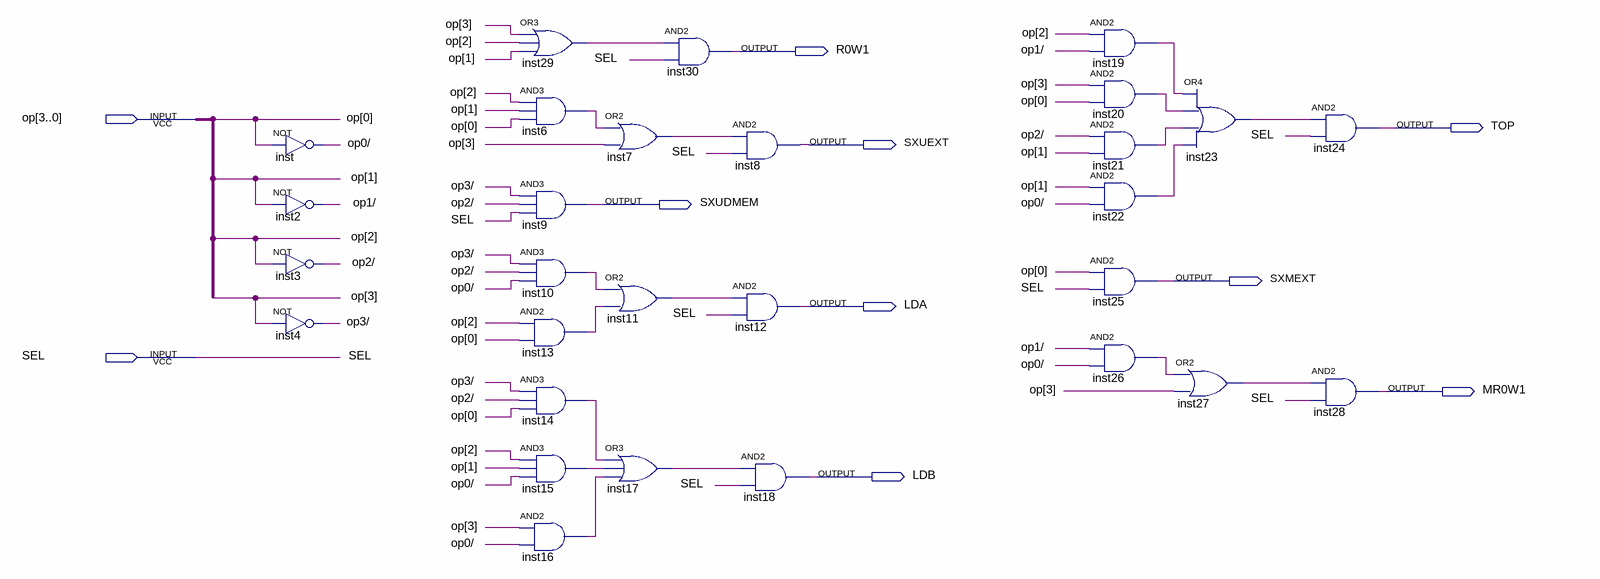
[diagram p0: schematic sheet]
// Quartus schematic decod_inst_trf_interno.bdf as structural Verilog: 29 symbols, 10 pins
module decod_inst_trf_interno (
  input  [3:0] op,
  input  SEL,
  output R0W1,
  output TOP,
  output SXUEXT,
  output SXUDMEM,
  output SXMEXT,
  output LDA,
  output MR0W1,
  output LDB
);

  wire inst6_out, inst7_out, inst10_out, inst11_out, inst13_out, inst14_out, inst15_out, inst16_out,
       inst17_out, inst19_out, inst20_out, inst21_out, inst22_out, inst23_out, inst26_out, inst27_out,
       inst29_out, \op0/ , \op1/ , \op2/ , \op3/ ;

  not inst (\op0/ , op[0]);
  not inst2 (\op1/ , op[1]);
  not inst3 (\op2/ , op[2]);
  not inst4 (\op3/ , op[3]);
  or inst29 (inst29_out, op[3], op[2], op[1]);
  and inst6 (inst6_out, op[2], op[1], op[0]);
  and inst9 (SXUDMEM, \op3/ , \op2/ , SEL);
  and inst10 (inst10_out, \op3/ , \op2/ , \op0/ );
  and inst13 (inst13_out, op[2], op[0]);
  and inst14 (inst14_out, \op3/ , \op2/ , op[0]);
  and inst15 (inst15_out, op[2], op[1], \op0/ );
  and inst16 (inst16_out, op[3], \op0/ );
  and inst30 (R0W1, inst29_out, SEL);
  or inst7 (inst7_out, inst6_out, op[3]);
  or inst11 (inst11_out, inst10_out, inst13_out);
  or inst17 (inst17_out, inst14_out, inst15_out, inst16_out);
  and inst8 (SXUEXT, inst7_out, SEL);
  and inst12 (LDA, inst11_out, SEL);
  and inst18 (LDB, inst17_out, SEL);
  and inst19 (inst19_out, op[2], \op1/ );
  and inst20 (inst20_out, op[3], op[0]);
  and inst21 (inst21_out, \op2/ , op[1]);
  and inst22 (inst22_out, op[1], \op0/ );
  and inst25 (SXMEXT, op[0], SEL);
  and inst26 (inst26_out, \op1/ , \op0/ );
  or inst23 (inst23_out, inst19_out, inst20_out, inst21_out, inst22_out);
  or inst27 (inst27_out, inst26_out, op[3]);
  and inst24 (TOP, inst23_out, SEL);
  and inst28 (MR0W1, inst27_out, SEL);
endmodule
